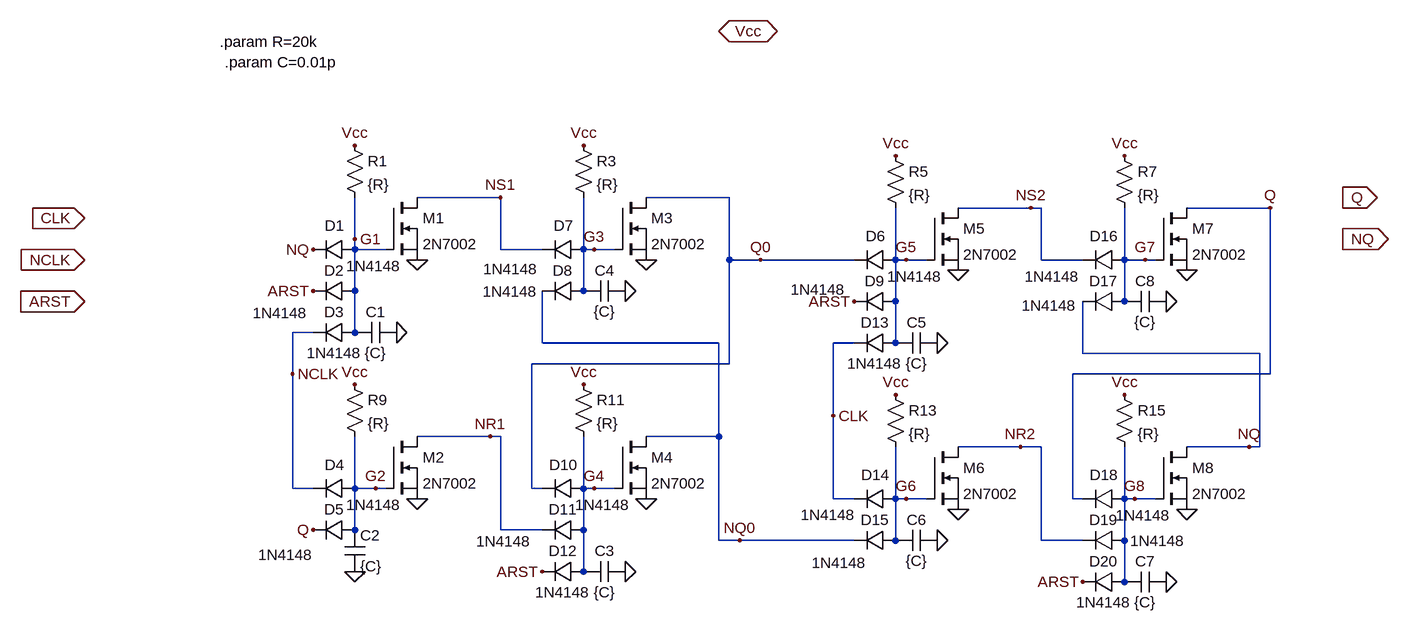
[diagram p0: schematic ff-arst-nmos-diode.asc]
ff-arst-nmos-diode.asc, the LTspice schematic file:
Version 4
SHEET 1 1760 800
WIRE 400 160 272 160
WIRE 752 160 624 160
WIRE 1216 176 1104 176
WIRE 1232 176 1216 176
WIRE 1584 176 1456 176
WIRE 176 224 176 160
WIRE 176 240 176 224
WIRE 224 240 176 240
WIRE 400 240 400 160
WIRE 464 240 400 240
WIRE 528 240 528 160
WIRE 544 240 528 240
WIRE 576 240 544 240
WIRE 752 256 752 160
WIRE 800 256 752 256
WIRE 944 256 800 256
WIRE 1008 256 1008 176
WIRE 1024 256 1008 256
WIRE 1056 256 1024 256
WIRE 1232 256 1232 176
WIRE 1296 256 1232 256
WIRE 1360 256 1360 176
WIRE 1392 256 1360 256
WIRE 1408 256 1392 256
WIRE 176 304 176 240
WIRE 528 304 528 240
WIRE 1008 320 1008 256
WIRE 1360 320 1360 256
WIRE 112 368 80 368
WIRE 176 368 176 304
WIRE 464 384 464 304
WIRE 736 384 464 384
WIRE 944 384 912 384
WIRE 1008 384 1008 320
WIRE 1296 400 1296 320
WIRE 1568 400 1296 400
WIRE 752 416 752 256
WIRE 752 416 448 416
WIRE 80 432 80 368
WIRE 1584 432 1584 176
WIRE 1584 432 1280 432
WIRE 912 496 912 384
WIRE 384 528 272 528
WIRE 400 528 384 528
WIRE 736 528 736 384
WIRE 736 528 624 528
WIRE 1200 544 1104 544
WIRE 1232 544 1200 544
WIRE 1552 544 1456 544
WIRE 1568 544 1568 400
WIRE 1568 544 1552 544
WIRE 80 608 80 432
WIRE 112 608 80 608
WIRE 176 608 176 528
WIRE 208 608 176 608
WIRE 224 608 208 608
WIRE 448 608 448 416
WIRE 464 608 448 608
WIRE 528 608 528 528
WIRE 544 608 528 608
WIRE 576 608 544 608
WIRE 912 624 912 496
WIRE 944 624 912 624
WIRE 1008 624 1008 544
WIRE 1024 624 1008 624
WIRE 1056 624 1024 624
WIRE 1280 624 1280 432
WIRE 1296 624 1280 624
WIRE 1360 624 1360 544
WIRE 1376 624 1360 624
WIRE 1408 624 1376 624
WIRE 176 672 176 608
WIRE 400 672 400 528
WIRE 464 672 400 672
WIRE 528 672 528 608
WIRE 736 688 736 528
WIRE 768 688 736 688
WIRE 944 688 768 688
WIRE 1008 688 1008 624
WIRE 1232 688 1232 544
WIRE 1296 688 1232 688
WIRE 1360 688 1360 624
WIRE 528 736 528 672
WIRE 1360 752 1360 688
FLAG 272 256 0
FLAG 272 624 0
FLAG 624 256 0
FLAG 624 624 0
FLAG 80 432 NCLK
FLAG 112 304 ARST
FLAG 464 736 ARST
FLAG 1104 272 0
FLAG 1104 640 0
FLAG 1456 272 0
FLAG 1456 640 0
FLAG 944 320 ARST
FLAG 1296 752 ARST
FLAG 912 496 CLK
FLAG 1584 176 Q
FLAG 112 240 NQ
FLAG 112 672 Q
FLAG -240 192 CLK
IOPIN -240 192 In
FLAG -240 256 NCLK
IOPIN -240 256 In
FLAG -240 320 ARST
IOPIN -240 320 In
FLAG 1696 160 Q
IOPIN 1696 160 Out
FLAG 1696 224 NQ
IOPIN 1696 224 Out
FLAG 176 80 Vcc
FLAG 528 80 Vcc
FLAG 1008 96 Vcc
FLAG 1360 96 Vcc
FLAG 1360 464 Vcc
FLAG 1008 464 Vcc
FLAG 528 448 Vcc
FLAG 176 448 Vcc
FLAG 736 -96 Vcc
IOPIN 736 -96 BiDir
FLAG 1552 544 NQ
FLAG 176 224 G1
FLAG 208 608 G2
FLAG 544 240 G3
FLAG 544 608 G4
FLAG 1024 256 G5
FLAG 1024 624 G6
FLAG 1392 256 G7
FLAG 1376 624 G8
FLAG 400 160 NS1
FLAG 384 528 NR1
FLAG 1216 176 NS2
FLAG 1200 544 NR2
FLAG 800 256 Q0
FLAG 768 688 NQ0
FLAG 240 368 0
FLAG 592 304 0
FLAG 592 736 0
FLAG 1072 688 0
FLAG 1072 384 0
FLAG 1424 320 0
FLAG 1424 752 0
FLAG 176 736 0
SYMBOL nmos 224 160 R0
SYMATTR InstName M1
SYMATTR Value 2N7002
SYMBOL diode 176 224 R90
WINDOW 0 -5 31 VBottom 2
WINDOW 3 26 -29 VTop 2
SYMATTR InstName D1
SYMATTR Value 1N4148
SYMBOL diode 176 288 R90
WINDOW 0 0 32 VBottom 2
WINDOW 3 34 115 VTop 2
SYMATTR InstName D2
SYMATTR Value 1N4148
SYMBOL diode 176 352 R90
WINDOW 0 0 32 VBottom 2
WINDOW 3 32 32 VTop 2
SYMATTR InstName D3
SYMATTR Value 1N4148
SYMBOL nmos 224 528 R0
SYMATTR InstName M2
SYMATTR Value 2N7002
SYMBOL diode 176 592 R90
WINDOW 0 -5 31 VBottom 2
WINDOW 3 26 -29 VTop 2
SYMATTR InstName D4
SYMATTR Value 1N4148
SYMBOL diode 176 656 R90
WINDOW 0 0 32 VBottom 2
WINDOW 3 39 106 VTop 2
SYMATTR InstName D5
SYMATTR Value 1N4148
SYMBOL nmos 576 160 R0
SYMATTR InstName M3
SYMATTR Value 2N7002
SYMBOL diode 528 224 R90
WINDOW 0 -5 31 VBottom 2
WINDOW 3 31 112 VTop 2
SYMATTR InstName D7
SYMATTR Value 1N4148
SYMBOL diode 528 288 R90
WINDOW 0 0 32 VBottom 2
WINDOW 3 1 113 VTop 2
SYMATTR InstName D8
SYMATTR Value 1N4148
SYMBOL nmos 576 528 R0
SYMATTR InstName M4
SYMATTR Value 2N7002
SYMBOL diode 528 592 R90
WINDOW 0 -5 31 VBottom 2
WINDOW 3 26 -29 VTop 2
SYMATTR InstName D10
SYMATTR Value 1N4148
SYMBOL diode 528 656 R90
WINDOW 0 0 32 VBottom 2
WINDOW 3 18 123 VTop 2
SYMATTR InstName D11
SYMATTR Value 1N4148
SYMBOL diode 528 720 R90
WINDOW 0 0 32 VBottom 2
WINDOW 3 32 32 VTop 2
SYMATTR InstName D12
SYMATTR Value 1N4148
SYMBOL nmos 1056 176 R0
SYMATTR InstName M5
SYMATTR Value 2N7002
SYMBOL diode 1008 240 R90
WINDOW 0 -5 31 VBottom 2
WINDOW 3 26 -29 VTop 2
SYMATTR InstName D6
SYMATTR Value 1N4148
SYMBOL diode 1008 304 R90
WINDOW 0 0 32 VBottom 2
WINDOW 3 -18 119 VTop 2
SYMATTR InstName D9
SYMATTR Value 1N4148
SYMBOL diode 1008 368 R90
WINDOW 0 0 32 VBottom 2
WINDOW 3 32 32 VTop 2
SYMATTR InstName D13
SYMATTR Value 1N4148
SYMBOL nmos 1056 544 R0
SYMATTR InstName M6
SYMATTR Value 2N7002
SYMBOL diode 1008 608 R90
WINDOW 0 -5 31 VBottom 2
WINDOW 3 99 87 VTop 2
SYMATTR InstName D14
SYMATTR Value 1N4148
SYMBOL diode 1008 672 R90
WINDOW 0 0 32 VBottom 2
WINDOW 3 -39 104 VTop 2
SYMATTR InstName D15
SYMATTR Value 1N4148
SYMBOL nmos 1408 176 R0
SYMATTR InstName M7
SYMATTR Value 2N7002
SYMBOL diode 1360 240 R90
WINDOW 0 -5 31 VBottom 2
WINDOW 3 26 111 VTop 2
SYMATTR InstName D16
SYMATTR Value 1N4148
SYMBOL diode 1360 304 R90
WINDOW 0 0 32 VBottom 2
WINDOW 3 7 116 VTop 2
SYMATTR InstName D17
SYMATTR Value 1N4148
SYMBOL nmos 1408 544 R0
SYMATTR InstName M8
SYMATTR Value 2N7002
SYMBOL diode 1360 608 R90
WINDOW 0 -5 31 VBottom 2
WINDOW 3 26 -29 VTop 2
SYMATTR InstName D18
SYMATTR Value 1N4148
SYMBOL diode 1360 672 R90
WINDOW 0 0 32 VBottom 2
WINDOW 3 1 -51 VTop 2
SYMATTR InstName D19
SYMATTR Value 1N4148
SYMBOL diode 1360 736 R90
WINDOW 0 0 32 VBottom 2
WINDOW 3 32 32 VTop 2
SYMATTR InstName D20
SYMATTR Value 1N4148
SYMBOL res 160 64 R0
SYMATTR InstName R1
SYMATTR Value {R}
SYMBOL res 512 64 R0
SYMATTR InstName R3
SYMATTR Value {R}
SYMBOL res 992 80 R0
SYMATTR InstName R5
SYMATTR Value {R}
SYMBOL res 1344 80 R0
SYMATTR InstName R7
SYMATTR Value {R}
SYMBOL res 160 432 R0
SYMATTR InstName R9
SYMATTR Value {R}
SYMBOL res 512 432 R0
SYMATTR InstName R11
SYMATTR Value {R}
SYMBOL res 992 448 R0
SYMATTR InstName R13
SYMATTR Value {R}
SYMBOL res 1344 448 R0
SYMATTR InstName R15
SYMATTR Value {R}
SYMBOL cap 240 352 R90
WINDOW 0 0 32 VBottom 2
WINDOW 3 32 32 VTop 2
SYMATTR InstName C1
SYMATTR Value {C}
SYMBOL cap 160 672 R0
SYMATTR InstName C2
SYMATTR Value {C}
SYMBOL cap 592 720 R90
WINDOW 0 0 32 VBottom 2
WINDOW 3 32 32 VTop 2
SYMATTR InstName C3
SYMATTR Value {C}
SYMBOL cap 592 288 R90
WINDOW 0 0 32 VBottom 2
WINDOW 3 32 32 VTop 2
SYMATTR InstName C4
SYMATTR Value {C}
SYMBOL cap 1072 368 R90
WINDOW 0 0 32 VBottom 2
WINDOW 3 32 32 VTop 2
SYMATTR InstName C5
SYMATTR Value {C}
SYMBOL cap 1072 672 R90
WINDOW 0 0 32 VBottom 2
WINDOW 3 32 32 VTop 2
SYMATTR InstName C6
SYMATTR Value {C}
SYMBOL cap 1424 736 R90
WINDOW 0 0 32 VBottom 2
WINDOW 3 32 32 VTop 2
SYMATTR InstName C7
SYMATTR Value {C}
SYMBOL cap 1424 304 R90
WINDOW 0 0 32 VBottom 2
WINDOW 3 32 32 VTop 2
SYMATTR InstName C8
SYMATTR Value {C}
TEXT -32 -80 Left 2 !.param R=20k
TEXT -24 -48 Left 2 !.param C=0.01p

The netlist it stands for:
* ff-arst-nmos-diode.asc
M1 NS1 G1 0 0 2N7002
D1 G1 NQ 1N4148
D2 G1 ARST 1N4148
D3 G1 NCLK 1N4148
M2 NR1 G2 0 0 2N7002
D4 G2 NCLK 1N4148
D5 G2 Q 1N4148
M3 Q0 G3 0 0 2N7002
D7 G3 NS1 1N4148
D8 G3 NQ0 1N4148
M4 NQ0 G4 0 0 2N7002
D10 G4 Q0 1N4148
D11 G4 NR1 1N4148
D12 G4 ARST 1N4148
M5 NS2 G5 0 0 2N7002
D6 G5 Q0 1N4148
D9 G5 ARST 1N4148
D13 G5 CLK 1N4148
M6 NR2 G6 0 0 2N7002
D14 G6 CLK 1N4148
D15 G6 NQ0 1N4148
M7 Q G7 0 0 2N7002
D16 G7 NS2 1N4148
D17 G7 NQ 1N4148
M8 NQ G8 0 0 2N7002
D18 G8 Q 1N4148
D19 G8 NR2 1N4148
D20 G8 ARST 1N4148
R1 Vcc G1 {R}
R3 Vcc G3 {R}
R5 Vcc G5 {R}
R7 Vcc G7 {R}
R9 Vcc G2 {R}
R11 Vcc G4 {R}
R13 Vcc G6 {R}
R15 Vcc G8 {R}
C1 0 G1 {C}
C2 G2 0 {C}
C3 0 G4 {C}
C4 0 G3 {C}
C5 0 G5 {C}
C6 0 G6 {C}
C7 0 G8 {C}
C8 0 G7 {C}
.model D D
.lib standard.dio
.model NMOS NMOS
.model PMOS PMOS
.lib standard.mos
.param R=20k
.param C=0.01p
.backanno
.end